# EAGLE design LM7805 (EAGLE 9.6.2)
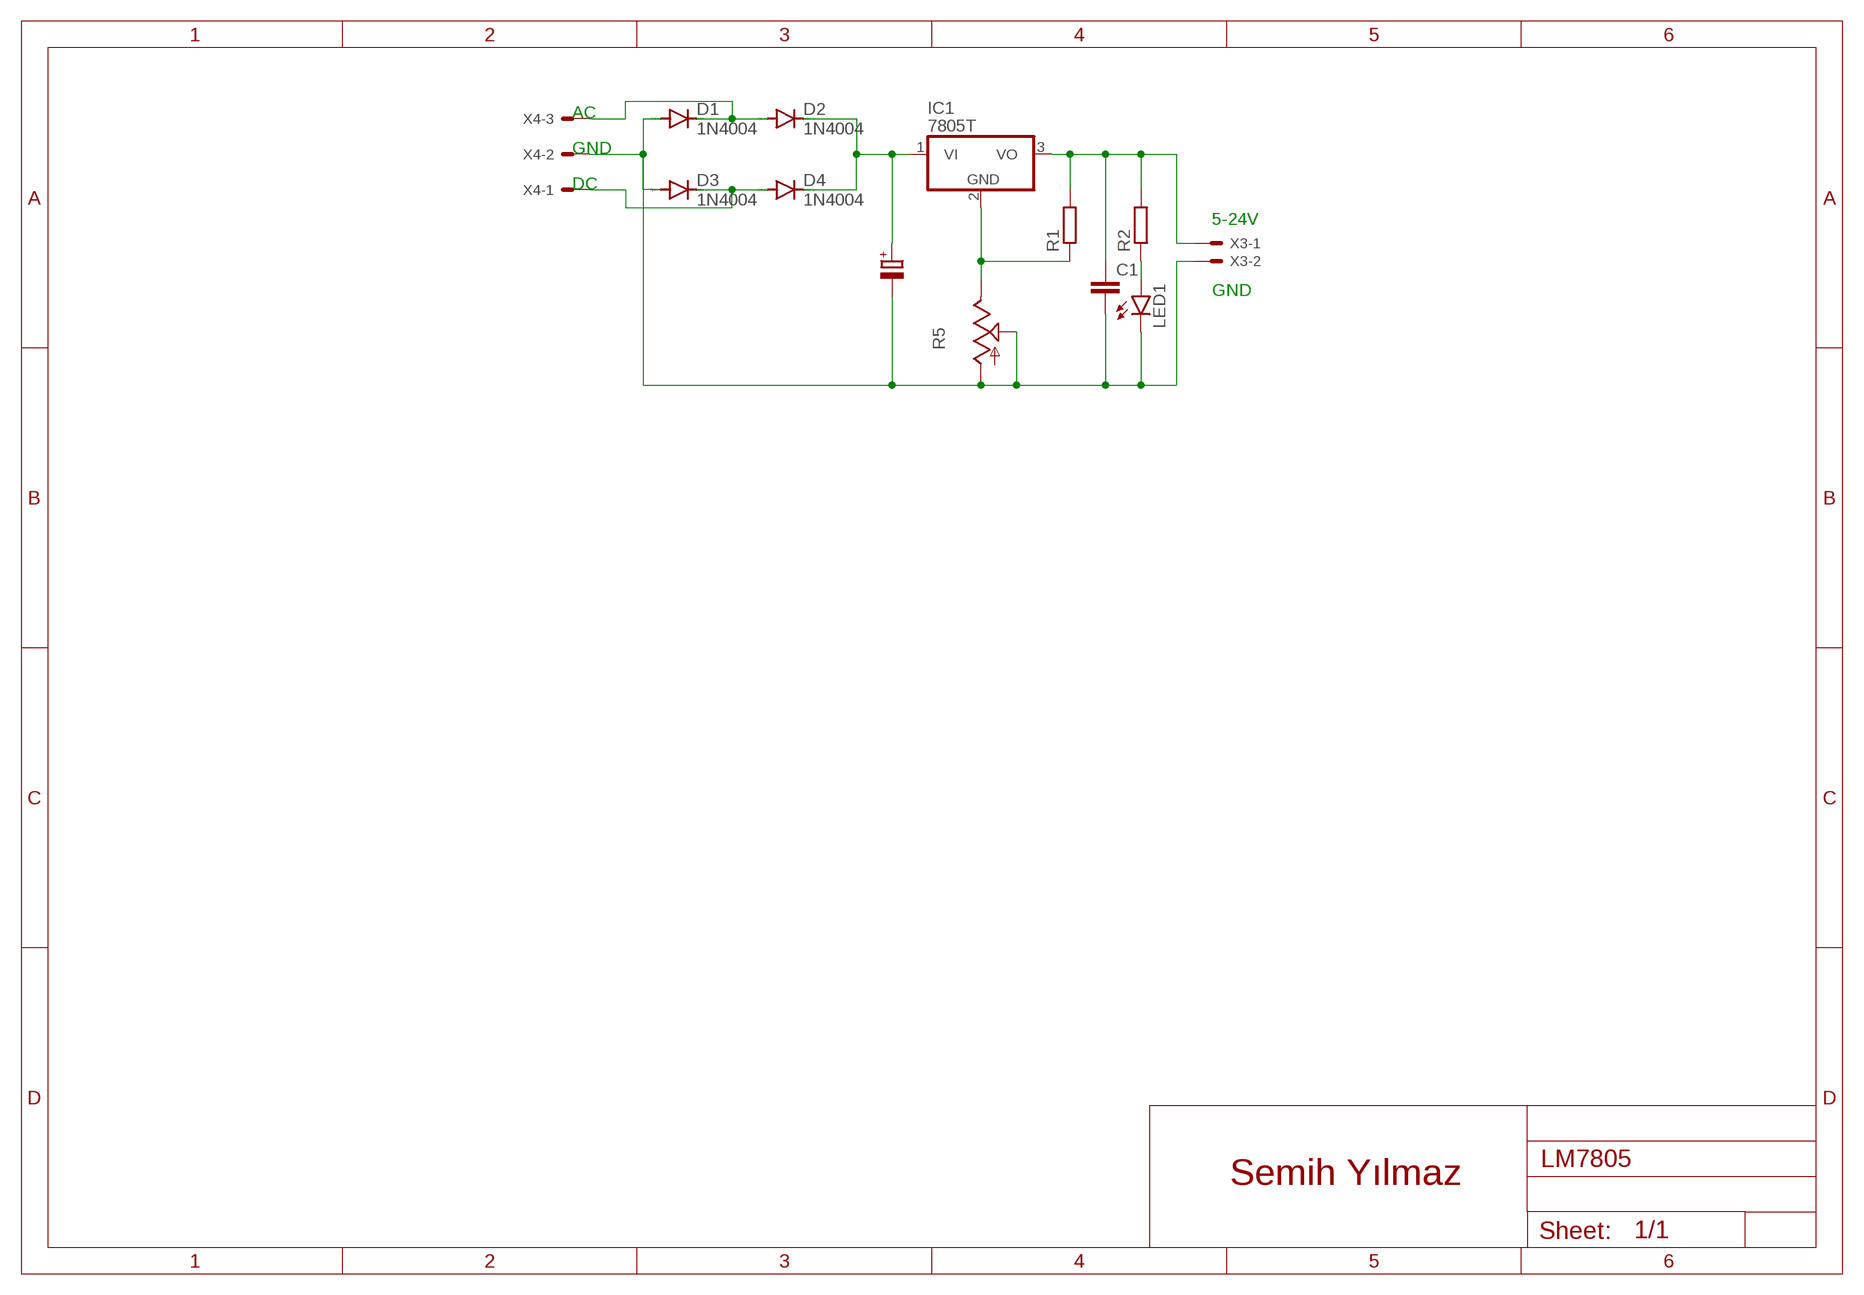
[diagram p0: schematic, sheet 1]

## Parts
C1  C2.5/2  [C2.5-2]
D1  1N4004  [DO41-10]
D2  1N4004  [DO41-10]
D3  1N4004  [DO41-10]
D4  1N4004  [DO41-10]
IC1  7805T  [TO220H]
LED1  LED3MM  [LED3MM]
R1  R-EU_0204/7  [0204/7]
R2  R-EU_0204/7  [0204/7]
R5  TRIM_US-S64W  [S64W]
X3  22-23-2021  [22-23-2021]
X4  22-23-2031  [22-23-2031]

## Nets
N$1: C1.2 D1.A D3.A LED1.K(C) R5.A R5.S X3.2 X4.2
N$3: D2.C D4.C IC1.1(VI)
N$5: C1.1 IC1.3(VO) R1.2 R2.2 X3.1
N$6: LED1.A R2.1
N$7: IC1.2(GND) R1.1 R5.E
N$8: D3.C D4.A X4.1
N$9: D1.C D2.A X4.3

## Notes on the sheet
- AC
- GND
- DC
- 5-24V
- GND
- Semih Yılmaz

## Library data of the parts
C1 = capacitor-wima:C: CAPACITOR naming: grid - package width
D1-D4 = diode:1N4004: DIODE general purpose rectifier, 1 A
IC1 = linear:78*: Positive VOLTAGE REGULATOR Source: http://cache.national.com/ds/LM/LM78L05.pdf http://www.fairchildsemi.com/ds/LM/LM7805.pdf
LED1 = led:LED: LED OSRAM: - CHIPLED LG R971, LG N971, LY N971, LG Q971, LY Q971, LO R971, LY R971 LH N974, LH R974 LS Q976, LO Q976, LY Q976 LO Q996 - Hyper CHIPLED LW Q18S LB Q993, LB Q99A, LB R99A - SideLED LS A670, LO A670, LY A670, LG A670, LP A670 LB A673, LV A673, LT A673, LW A673 LH A674 LY A675 LS A676, LA A676, LO A676, LY A676, LW A676 LS A679, LY A679, LG A679 - Hyper Micro SIDELED® LS Y876, LA Y876, LO Y876, LY Y876 LT Y87S - SmartLED LW L88C, LW L88S LB L89C, LB L89S, LG L890 LS L89K, LO L89K, LY L89K LS L896, LA L896, LO L896, LY L896 - TOPLED LS T670, LO T670, LY T670, LG T670, LP T670 LSG T670, LSP T670, LSY T670, LOP T670, LYG T670 LG T671, LOG T671, LSG T671 LB T673, LV T673, LT T673, LW T673 LH T674 LS T676, LA T676, LO T676, LY T676, LB T676, LH T676, LSB T676, LW T676 LB T67C, LV T67C, LT T67C, LS T67K, LO T67K, LY T67K, LW E67C LS E67B, LA E67B, LO E67B, LY E67B, LB E67C, LV E67C, LT E67C LW T67C LS T679, LY T679, LG T679 LS T770, LO T770, LY T770, LG T770, LP T770 LB T773, LV T773, LT T773, LW T773 LH T774 LS E675, LA E675, LY E675, LS T675 LS T776, LA T776, LO T776, LY T776, LB T776 LHGB T686 LT T68C, LB T68C - Hyper Mini TOPLED® LB M676 - Mini TOPLED Santana® LG M470 LS M47K, LO M47K, LY M47K Source: http://www.osram.convergy.de LUXEON: - LUMILED® LXK2-PW12-R00, LXK2-PW12-S00, LXK2-PW14-U00, LXK2-PW14-V00 LXK2-PM12-R00, LXK2-PM12-S00, LXK2-PM14-U00 LXK2-PE12-Q00, LXK2-PE12-R00, LXK2-PE12-S00, LXK2-PE14-T00, LXK2-PE14-U00 LXK2-PB12-K00, LXK2-PB12-L00, LXK2-PB12-M00, LXK2-PB14-N00, LXK2-PB14-P00, LXK2-PB14-Q00 LXK2-PR12-L00, LXK2-PR12-M00, LXK2-PR14-Q00, LXK2-PR14-R00 LXK2-PD12-Q00, LXK2-PD12-R00, LXK2-PD12-S00 LXK2-PH12-R00, LXK2-PH12-S00 LXK2-PL12-P00, LXK2-PL12-Q00, LXK2-PL12-R00 Source: www.luxeon.com KINGBRIGHT: KA-3528ASYC Source: www.kingbright.com
R1 R2 = rcl:R-EU_: RESISTOR, European symbol; SPICEPREFIX: R
R5 = pot:TRIM_US-: POTENTIOMETER
X3 = con-molex:22-23-2021: .100" (2.54mm) Center Header - 2 Pin; MF: MOLEX; MPN: 22-23-2021; OC_FARNELL: 1462926; OC_NEWARK: 25C3832
X4 = con-molex:22-23-2031: .100" (2.54mm) Center Header - 3 Pin; MF: MOLEX; MPN: 22-23-2031; OC_FARNELL: 1462950; OC_NEWARK: 30C0862

## Board
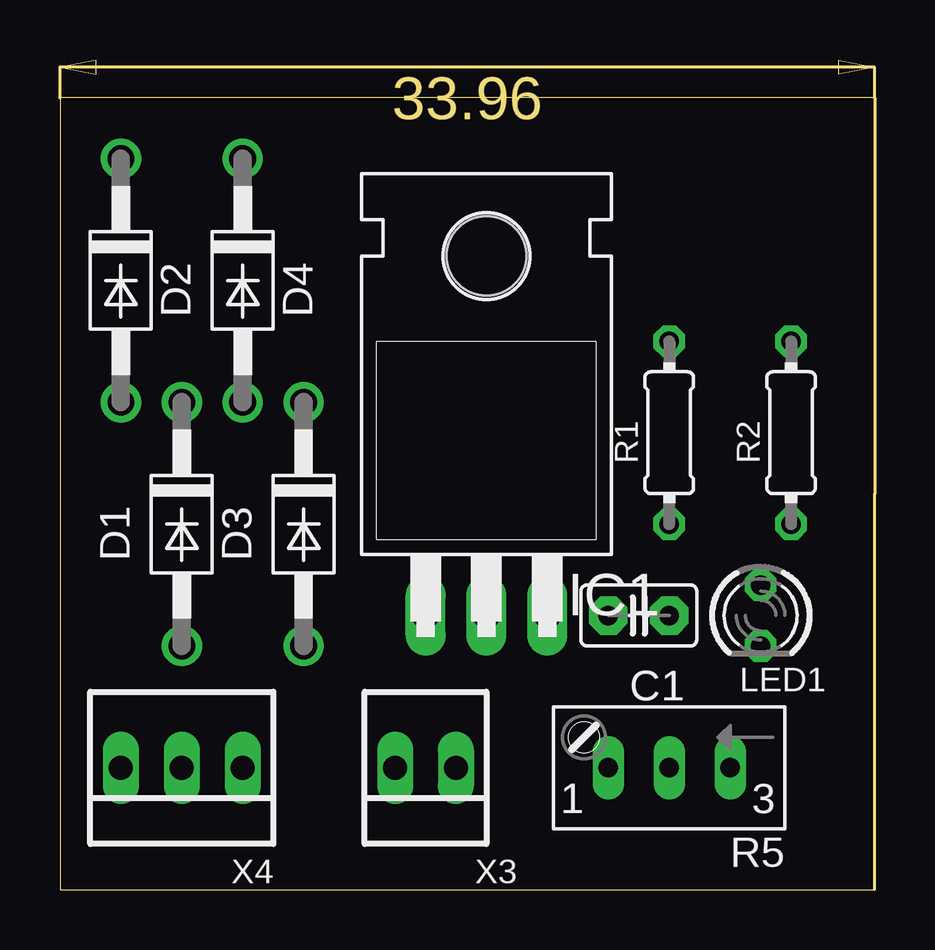
[diagram p1: board, top side]
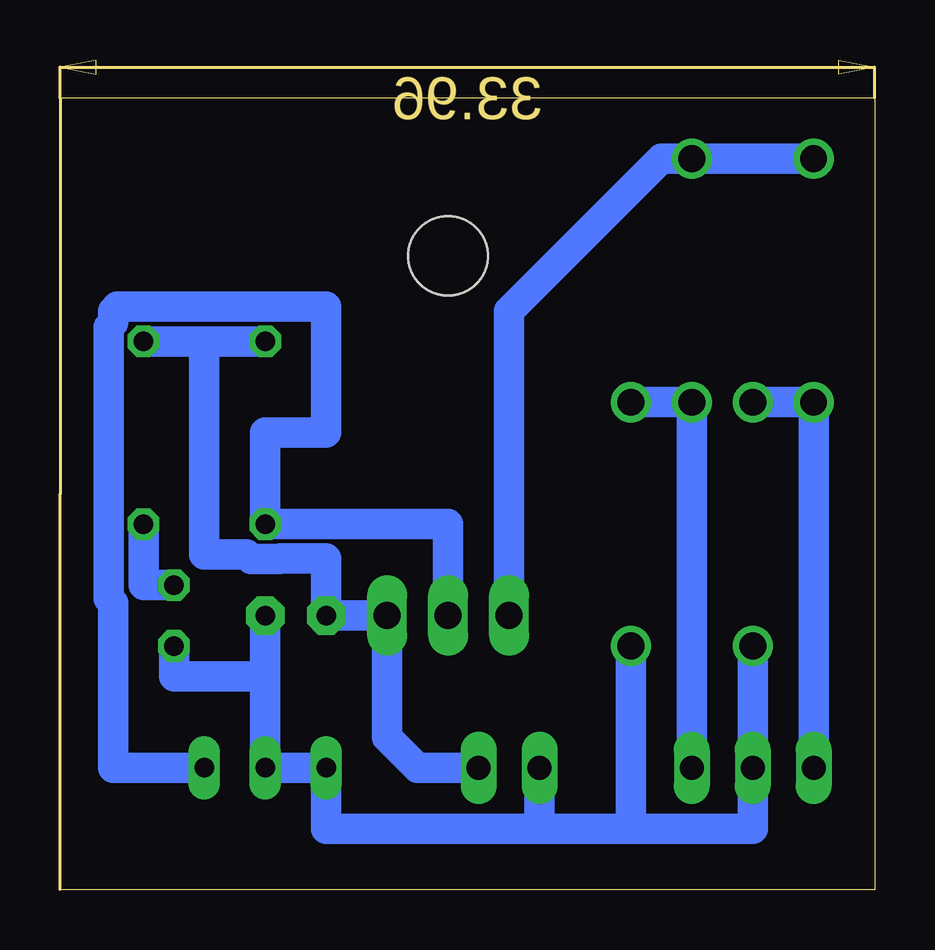
[diagram p2: board, bottom side, seen from below]

Size 33.96 x 33.01 mm. Coordinates in mm from the lower left corner, seen from the top.
Outline: 0,0 33.96,0 33.96,33.01 0,33.01 0,0
Copper layers (1*16): Top 0.035mm / dielectric 1.5mm / Bottom 0.035mm
Design rules "default": minimum track width 6mil, minimum drill 0.35mm, track to track 6mil, track to pad 6mil, pad to pad 6mil, via to via 6mil, smd to smd 6mil, copper to edge 40mil, drill to drill 6mil, minimum pad ring 10mil, minimum via ring 8mil, stop-mask expansion 4mil, vias tented up to drill 0mil, thermal gap 10mil

### Footprints (pad centres in the part's own frame; a part is rotated, then mirrored left to right if it is on the bottom)
C2.5-2 = drill 0.813 pad 1.6 octagon: 1 -1.27,0; 2 1.27,0
DO41-10 = drill 1.118: A 5.08,0; C -5.08,0
TO220H = drill 1.118 long: 1 -2.54,-10.16; 2 0,-10.16; 3 2.54,-10.16 | hole 3.302: 0,4.826
LED3MM = drill 0.813 octagon: A -1.27,0; K 1.27,0
0204/7 = drill 0.813 octagon: 1 -3.81,0; 2 3.81,0
S64W = drill 0.813 long: A 2.54,1.27; E -2.54,1.27; S 0,1.27
22-23-2021 = drill 1 long: 1 -1.27,0; 2 1.27,0
22-23-2031 = drill 1 long: 1 -2.54,0; 2 0,0; 3 2.54,0

### Placement (x,y rotation side)
C1  24.13,11.43 0 top
D1  5.08,15.24 270 top
D2  2.54,25.4 270 top
D3  10.16,15.24 270 top
D4  7.62,25.4 270 top
IC1  17.78,21.59 0 top
LED1  29.21,11.43 270 top
R1  25.4,19.05 90 top
R2  30.48,19.05 90 top
R5  25.4,6.35 180 top
X3  15.24,5.08 180 top
X4  5.08,5.08 180 top

### Tracks (layer width: path | path; a pad name or v marks a point on that pad's centre or on a via)
N$1
  Top 0.152: 22.81,5.18 R5.A
  Bottom 0.152: 5.08,10.26 D1.A
  Bottom 1.27: D1.A X4.2 5.08,2.54 10.16,2.54 | LED1.K 29.21,8.89 25.4,8.89 | 25.4,8.89 R5.S R5.A 22.86,2.54 13.97,2.54 | 10.16,2.54 13.97,2.54 | D3.A 10.16,2.54 | X3.2 13.97,2.54 | C1.2 25.4,8.89
N$3
  Bottom 1.27: D2.C D4.C 8.89,30.48 15.24,24.13 IC1.1
N$5
  Bottom 1.27: X3.1 19.05,5.08 20.32,6.35 IC1.3 C1.1 22.86,13.82 24.77,13.82 24.8,13.79 26,13.79 26.18,13.97 27.94,13.97 27.94,22.86 | R1.2 27.94,22.86 | 27.94,22.86 R2.2
N$6
  Bottom 1.27: R2.1 30.48,12.7 LED1.A
N$7
  Bottom 1.27: 17.78,15.24 R1.1 25.4,19.05 22.86,19.05 22.86,24.31 31.57,24.31 31.75,24.13 31.75,23.64 31.93,23.46 31.93,12.14 31.75,11.96 31.75,5.08 R5.E | 17.78,15.24 | 17.78,15.24 IC1.2
N$8
  Bottom 1.27: D3.C D4.A X4.1
N$9
  Bottom 1.27: D1.C D2.A X4.3